# Altium schematic sheet [09] - REVISION HISTORY.SchDoc
size A3; DocumentNumber: 9; SheetNumber: 9; SheetTotal: 9
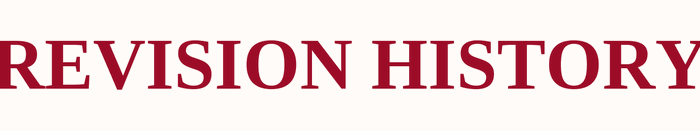
[diagram p0: [09] - REVISION HISTORY.SchDoc]

## Notes on the sheet
- REVISION HISTORY